# Altium schematic sheet sram.SchDoc: Test
size A4; DrawnBy: Łukasz Przeniosło; Organization: Apptimia sp. z o.o.; Address1: Wojska Polskiego 184c/4; Address2: 71-256 Szczecin; Address3: www.apptimia.com; DocumentNumber: 6; Revision: 1; SheetNumber: 6; SheetTotal: 12
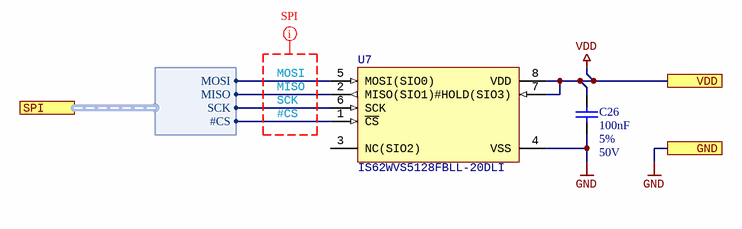
[diagram p0: sram.SchDoc]

## Parts
C26  100nF  Tolerance: 5%  Voltage: 50V  [CAPC1608N]
U7  IS62WVS5128FBLL-20DLI  [SO-8_L]

## Ports
GND, SPI (harness SPI), VDD

## Harnesses
SPI: MOSI, MISO, SCK, #CS

## Nets
GND: C26.1 U7.4(VSS) ; port GND
VDD: C26.2 U7.7(#HOLD(SIO3)) U7.8(VDD) ; port VDD
#CS: U7.1(~{CS}) ; port SPI.#CS
MISO: U7.2(MISO(SIO1)) ; port SPI.MISO
MOSI: U7.5(MOSI(SIO0)) ; port SPI.MOSI
SCK: U7.6(SCK) ; port SPI.SCK

Not connected (* = marked no-connect by the designer): U7 3(NC)

## Layout directives
net class SPI: #CS, MISO, MOSI, SCK

## Notes on the sheet
- Title
- Size:
- Date:
- A4
- Author:
- Time:
- Sheet
- of
- File:

## Library data of the parts
C26 = Capacitor: Value: 100nF
U7 = IS62WVS5128FBLL-20xLI: 512Kx8 LOW VOLTAGE, SERIAL SRAM with SPI, SDI and SQI INTERFACE; manid: IS62WVS5128FBLL-20DLI